# EAGLE schematic Controler 2_25 (EAGLE 9.0.0)
CNAME: Franks FlightSim Boards; CPROJECT: Franks FlightSim Boards; CREVISION: v0.1; DESIGNER: Frank van Ierland
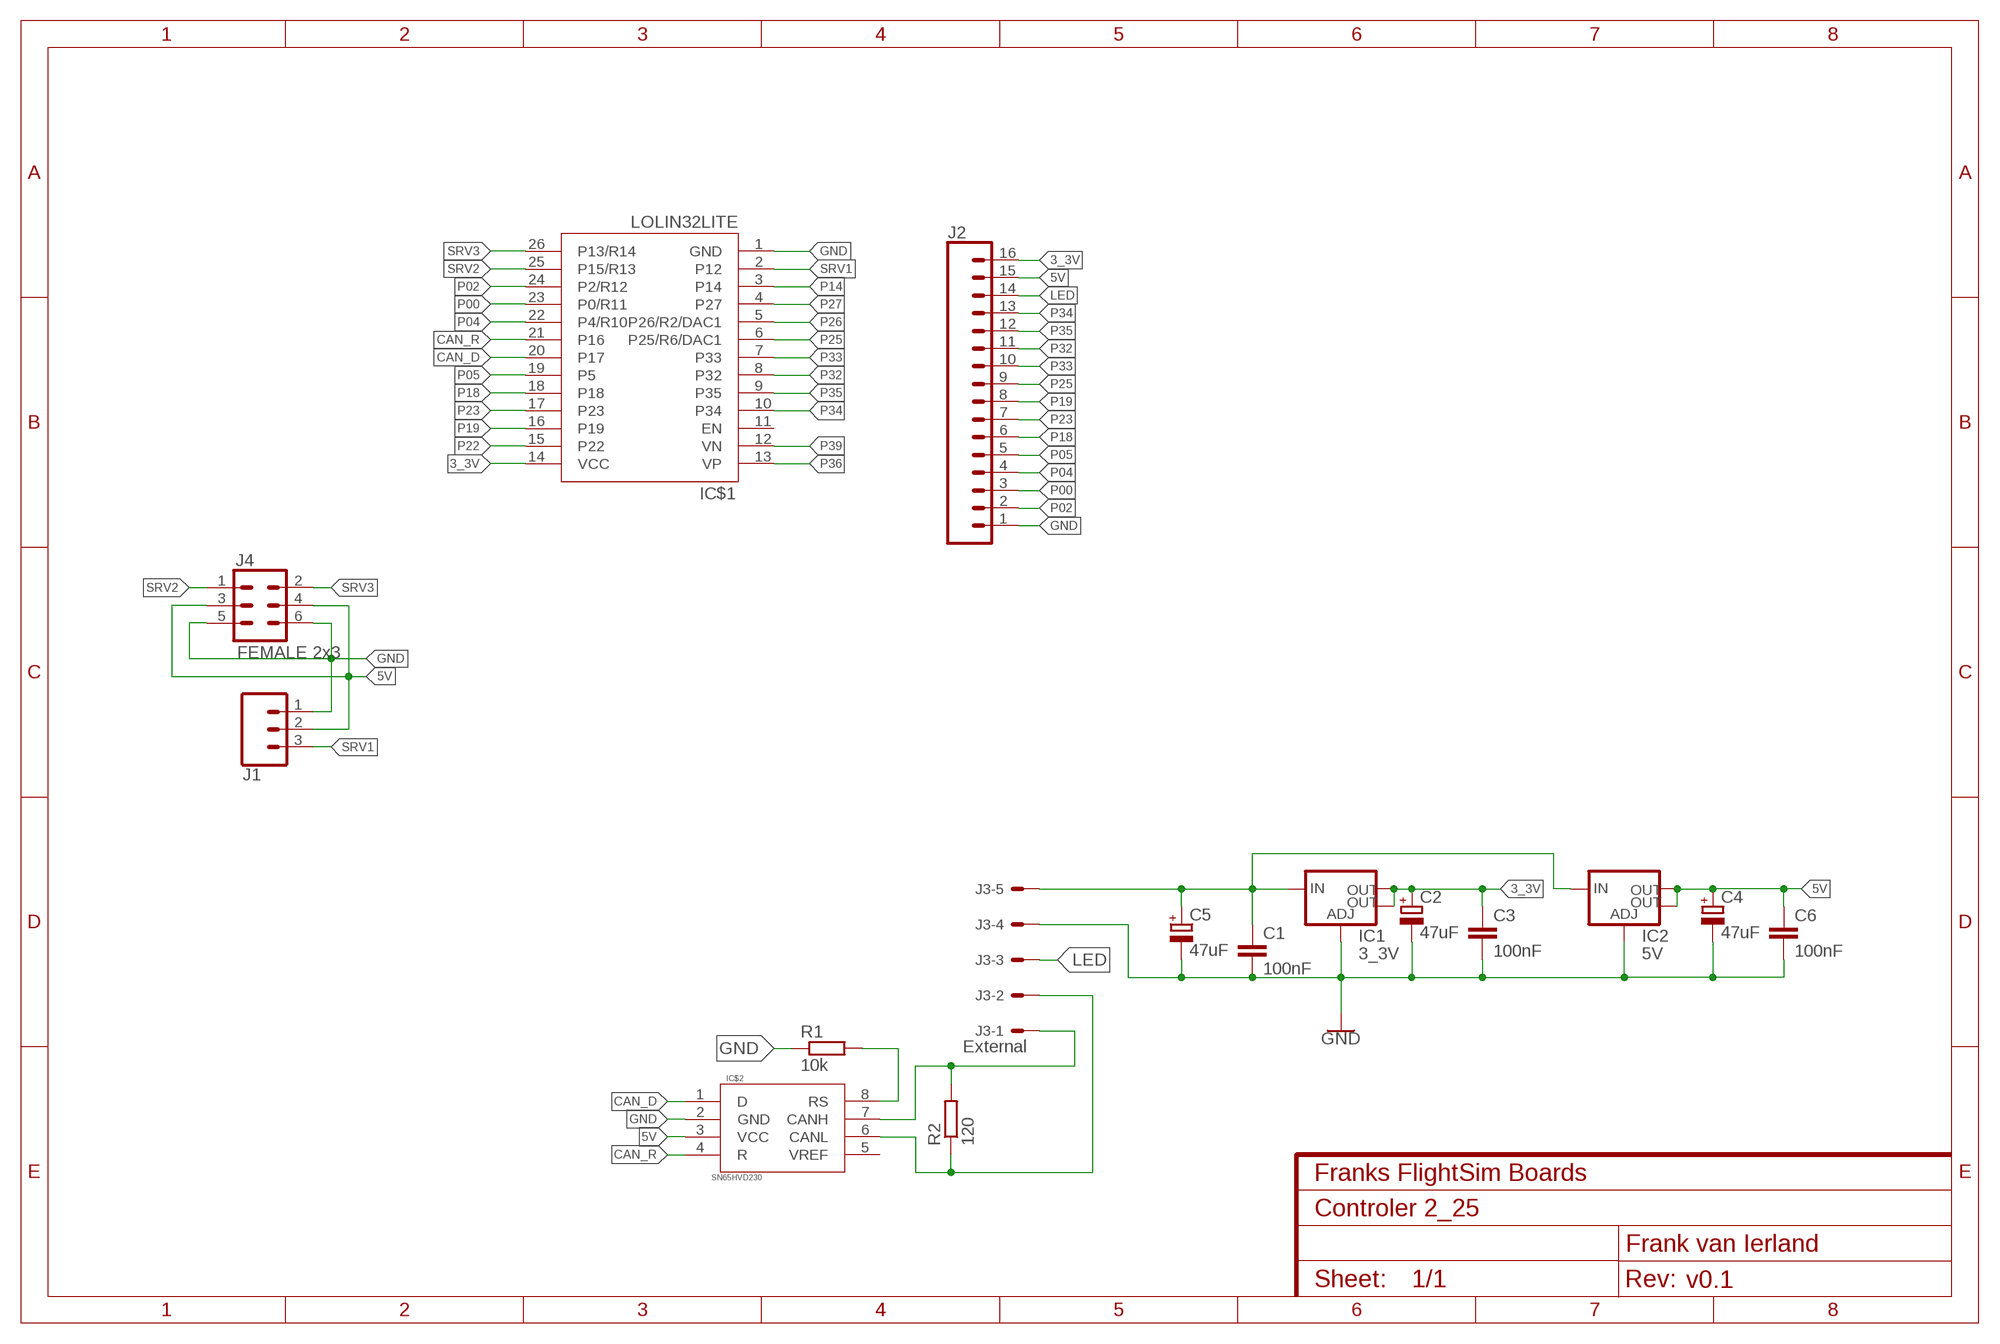
[diagram p0: schematic, sheet 1]

## Parts
C1  100nF  C-EUC1206  [C1206]
C2  47uF  CPOL-EUCT3528  [CT3528]
C3  100nF  C-EUC1206  [C1206]
C4  47uF  CPOL-EUCT3528  [CT3528]
C5  47uF  CPOL-EU153CLV-0605  [153CLV-0605]
C6  100nF  C-EUC1206  [C1206]
IC1  3_3V  V_REG_LM1117SOT223  [SOT223]
IC2  5V  V_REG_LM1117SOT223  [SOT223]
IC$1  LOLIN32LITE  [LOLIN32LITE]
IC$2  SN65HVD230  [SO08]
J1  CONN_03  [1X03]
J2  CONN_16  [1X16]
J3  External  22-27-2051-05  [6410-05]
J4  FEMALE 2x3  CONN_03X2FEMALE  [2X3]
R1  10k  R-EU_M1206  [M1206]
R2  120  R-EU_R1210  [R1210]

## Nets
3_3V [3_3V]: C2.-(+) C3.1 IC1.2(OUT) IC1.4(OUT) IC$1.14(VCC) J2.16
5V [5V]: C4.-(+) C6.1 IC2.2(OUT) IC2.4(OUT) IC$2.3(VCC) J1.2 J2.15 J4.3 J4.4
12V [12V]: C1.1 C5.+ IC1.3(IN) IC2.3(IN) J3.5
CAN_D: IC$1.20(P17) IC$2.1(D)
CAN_R: IC$1.21(P16) IC$2.4(R)
GND [GND]: C1.2 C2.+(-) C3.2 C4.+(-) C5.- C6.2 IC1.1(ADJ) IC2.1(ADJ) IC$1.1(GND) IC$2.2(GND) J1.1 J2.1 J3.4 J4.5 J4.6 R1.1
LED [LED]: J2.14 J3.3
N$1: IC$2.8(RS) R1.2
N$2: IC$2.7(CANH) J3.1 R2.2
N$3: IC$2.6(CANL) J3.2 R2.1
P00: IC$1.23(P0/R11) J2.3
P02: IC$1.24(P2/R12) J2.2
P04: IC$1.22(P4/R10) J2.4
P05: IC$1.19(P5) J2.5
P14: IC$1.3(P14)
P18: IC$1.18 J2.6
P19: IC$1.16(P19) J2.8
P22: IC$1.15(P22)
P23: IC$1.17(P23) J2.7
P25: IC$1.6(P25/R6/DAC1) J2.9
P26: IC$1.5(P26/R2/DAC1)
P27: IC$1.4(P27)
P32: IC$1.8(P32) J2.11
P33: IC$1.7(P33) J2.10
P34: IC$1.10(P34) J2.13
P35: IC$1.9(P35) J2.12
P36: IC$1.13(VP)
P39: IC$1.12(VN)
SRV1: IC$1.2(P12) J1.3
SRV2: IC$1.25(P15/R13) J4.1
SRV3: IC$1.26(P13/R14) J4.2
Unconnected: IC$1.11(EN) IC$2.5(VREF)

## Library data of the parts
C1 C3 C6 = resistor:C-EU: CAPACITOR, European symbol
C2 C4 C5 = resistor:CPOL-EU: POLARIZED CAPACITOR, European symbol
IC1 IC2 = SparkFun-IC-Power:V_REG_LM1117: Voltage Regulator LM1117 Standard adjustable voltage regulator but in SMD form. Spark Fun Electronics SKU : COM-00595; PROD_ID: VREG-08170
IC$1 = Franks:LOLIN32LITE
IC$2 = Franks:SN65HVD230
J1 = SparkFun-Connectors:CONN_03: Multi connection point. Often used as Generic Header-pin footprint for 0.1 inch spaced/style header connections On any of the 0.1 inch spaced packages, you can populate with these: Break Away Headers - Straight <https://www.sparkfun.com/products/116> (PRT-00116) Break Away Male Headers - Right Angle <https://www.sparkfun.com/products/553> (PRT-00553) Female Headers <https://www.sparkfun.com/products/115> (PRT-00115) Break Away Headers - Machine Pin <https://www.sparkfun.com/products/117> (PRT-00117) Break Away Female Headers - Swiss Machine Pin <https://www.sparkfun.com/products/743> (PRT-00743) Stackable Header - 3 Pin (Female, 0.1") <https://www.sparkfun.com/products/13875> (PRT-13875) For SCREWTERMINALS and SPRING TERMINALS visit here: Screw Terimnals on SparkFun.com <https://www.sparkfun.com/search/results?term=Screw+Terminals> (5mm/3.5mm/2.54mm spacing) This device is also useful as a general connection point to wire up your design to another part of your project. Our various solder wires solder well into these plated through hole pads. Hook-Up Wire - Assortment (Stranded, 22 AWG) <https://www.sparkfun.com/products/11375> (PRT-11375) Hook-Up Wire - Assortment (Solid Core, 22 AWG) <https://www.sparkfun.com/products/11367> (PRT-11367) View the entire wire category on our website here <https://www.sparkfun.com/categories/141> Special notes: Molex polarized connector foot print use with SKU : PRT-08232 with associated crimp pins and housings.
J2 = SparkFun-Connectors:CONN_16: Multi connection point. Often used as Generic Header-pin footprint for 0.1 inch spaced/style header connections On any of the 0.1 inch spaced packages, you can populate with these: Break Away Headers - Straight <https://www.sparkfun.com/products/116> (PRT-00116) Break Away Male Headers - Right Angle <https://www.sparkfun.com/products/553> (PRT-00553) Female Headers <https://www.sparkfun.com/products/115> (PRT-00115) Break Away Headers - Machine Pin <https://www.sparkfun.com/products/117> (PRT-00117) Break Away Female Headers - Swiss Machine Pin <https://www.sparkfun.com/products/743> (PRT-00743) For SCREWTERMINALS and SPRING TERMINALS visit here: Screw Terimnals on SparkFun.com <https://www.sparkfun.com/search/results?term=Screw+Terminals> (5mm/3.5mm/2.54mm spacing) This device is also useful as a general connection point to wire up your design to another part of your project. Our various solder wires solder well into these plated through hole pads. Hook-Up Wire - Assortment (Stranded, 22 AWG) <https://www.sparkfun.com/products/11375> (PRT-11375) Hook-Up Wire - Assortment (Solid Core, 22 AWG) <https://www.sparkfun.com/products/11367> (PRT-11367) View the entire wire category on our website here <https://www.sparkfun.com/categories/141> Special notes: Molex polarized connector foot print use with SKU : PRT-08231 with associated crimp pins and housings. 1MM SMD Version SKU: PRT-10208 NOTES ON THE VARIANTS LOCK and LOCK_LONGPADS... This footprint was designed to help hold the alignment of a through-hole component (i.e. 6-pin header) while soldering it into place. You may notice that each hole has been shifted either up or down by 0.005 of an inch from it's more standard position (which is a perfectly straight line). This slight alteration caused the pins (the squares in the middle) to touch the edges of the holes. Because they are alternating, it causes a "brace" to hold the component in place. 0.005 has proven to be the perfect amount of "off-center" position when using our standard breakaway headers. Although looks a little odd when you look at the bare footprint, once you have a header in there, the alteration is very hard to notice. Also,if you push a header all the way into place, it is covered up entirely on the bottom side.
J3 = con-molex:22-?-05: CONNECTOR wire to board 2.54 mm (.1 inch) pitch header; MF: MOLEX; OC_FARNELL: unknown; OC_NEWARK: unknown
J4 = SparkFun-Connectors:CONN_03X2: Multi connection point. Often used as Generic Header-pin footprint for 0.1 inch spaced/style header connections You can populate with any combo of single row headers, but if you'd like an exact match, check these: Header - 2x3 (Male, 0.1") <https://www.sparkfun.com/products/12807> (PRT-12807) Header - 2x3 (Female, 0.1") <https://www.sparkfun.com/products/13010> (PRT-13010) 2x3 Pin Shrouded Header <https://www.sparkfun.com/products/10877> (PRT-10877) On any of the 0.1 inch spaced packages, you can populate with these: Break Away Headers - Straight <https://www.sparkfun.com/products/116> (PRT-00116) Break Away Male Headers - Right Angle <https://www.sparkfun.com/products/553> (PRT-00553) Female Headers <https://www.sparkfun.com/products/115> (PRT-00115) Break Away Headers - Machine Pin <https://www.sparkfun.com/products/117> (PRT-00117) Break Away Female Headers - Swiss Machine Pin <https://www.sparkfun.com/products/743> (PRT-00743) Special note: the shrouded connector mates well with our 3x2 ribbon cables: Ribbon Crimp Connector - 6-pin (2x3, Female) <https://www.sparkfun.com/products/10651> (PRT-10651) Ribbon Cable - 6 wire (15ft) <https://www.sparkfun.com/products/10646> (PRT-10646); PROD_ID: CONN-11566
R1 R2 = resistor:R-EU_: RESISTOR, European symbol

## Net classes
1 GND: width 0.508 mm, clearance 0.254 mm
2 12V: width 0.762 mm
3 3_3V: width 0.508 mm
4 5V: width 0.508 mm
5 LED: width 0.508 mm